# EAGLE design DigitalYSplitter (EAGLE 7.2.0)
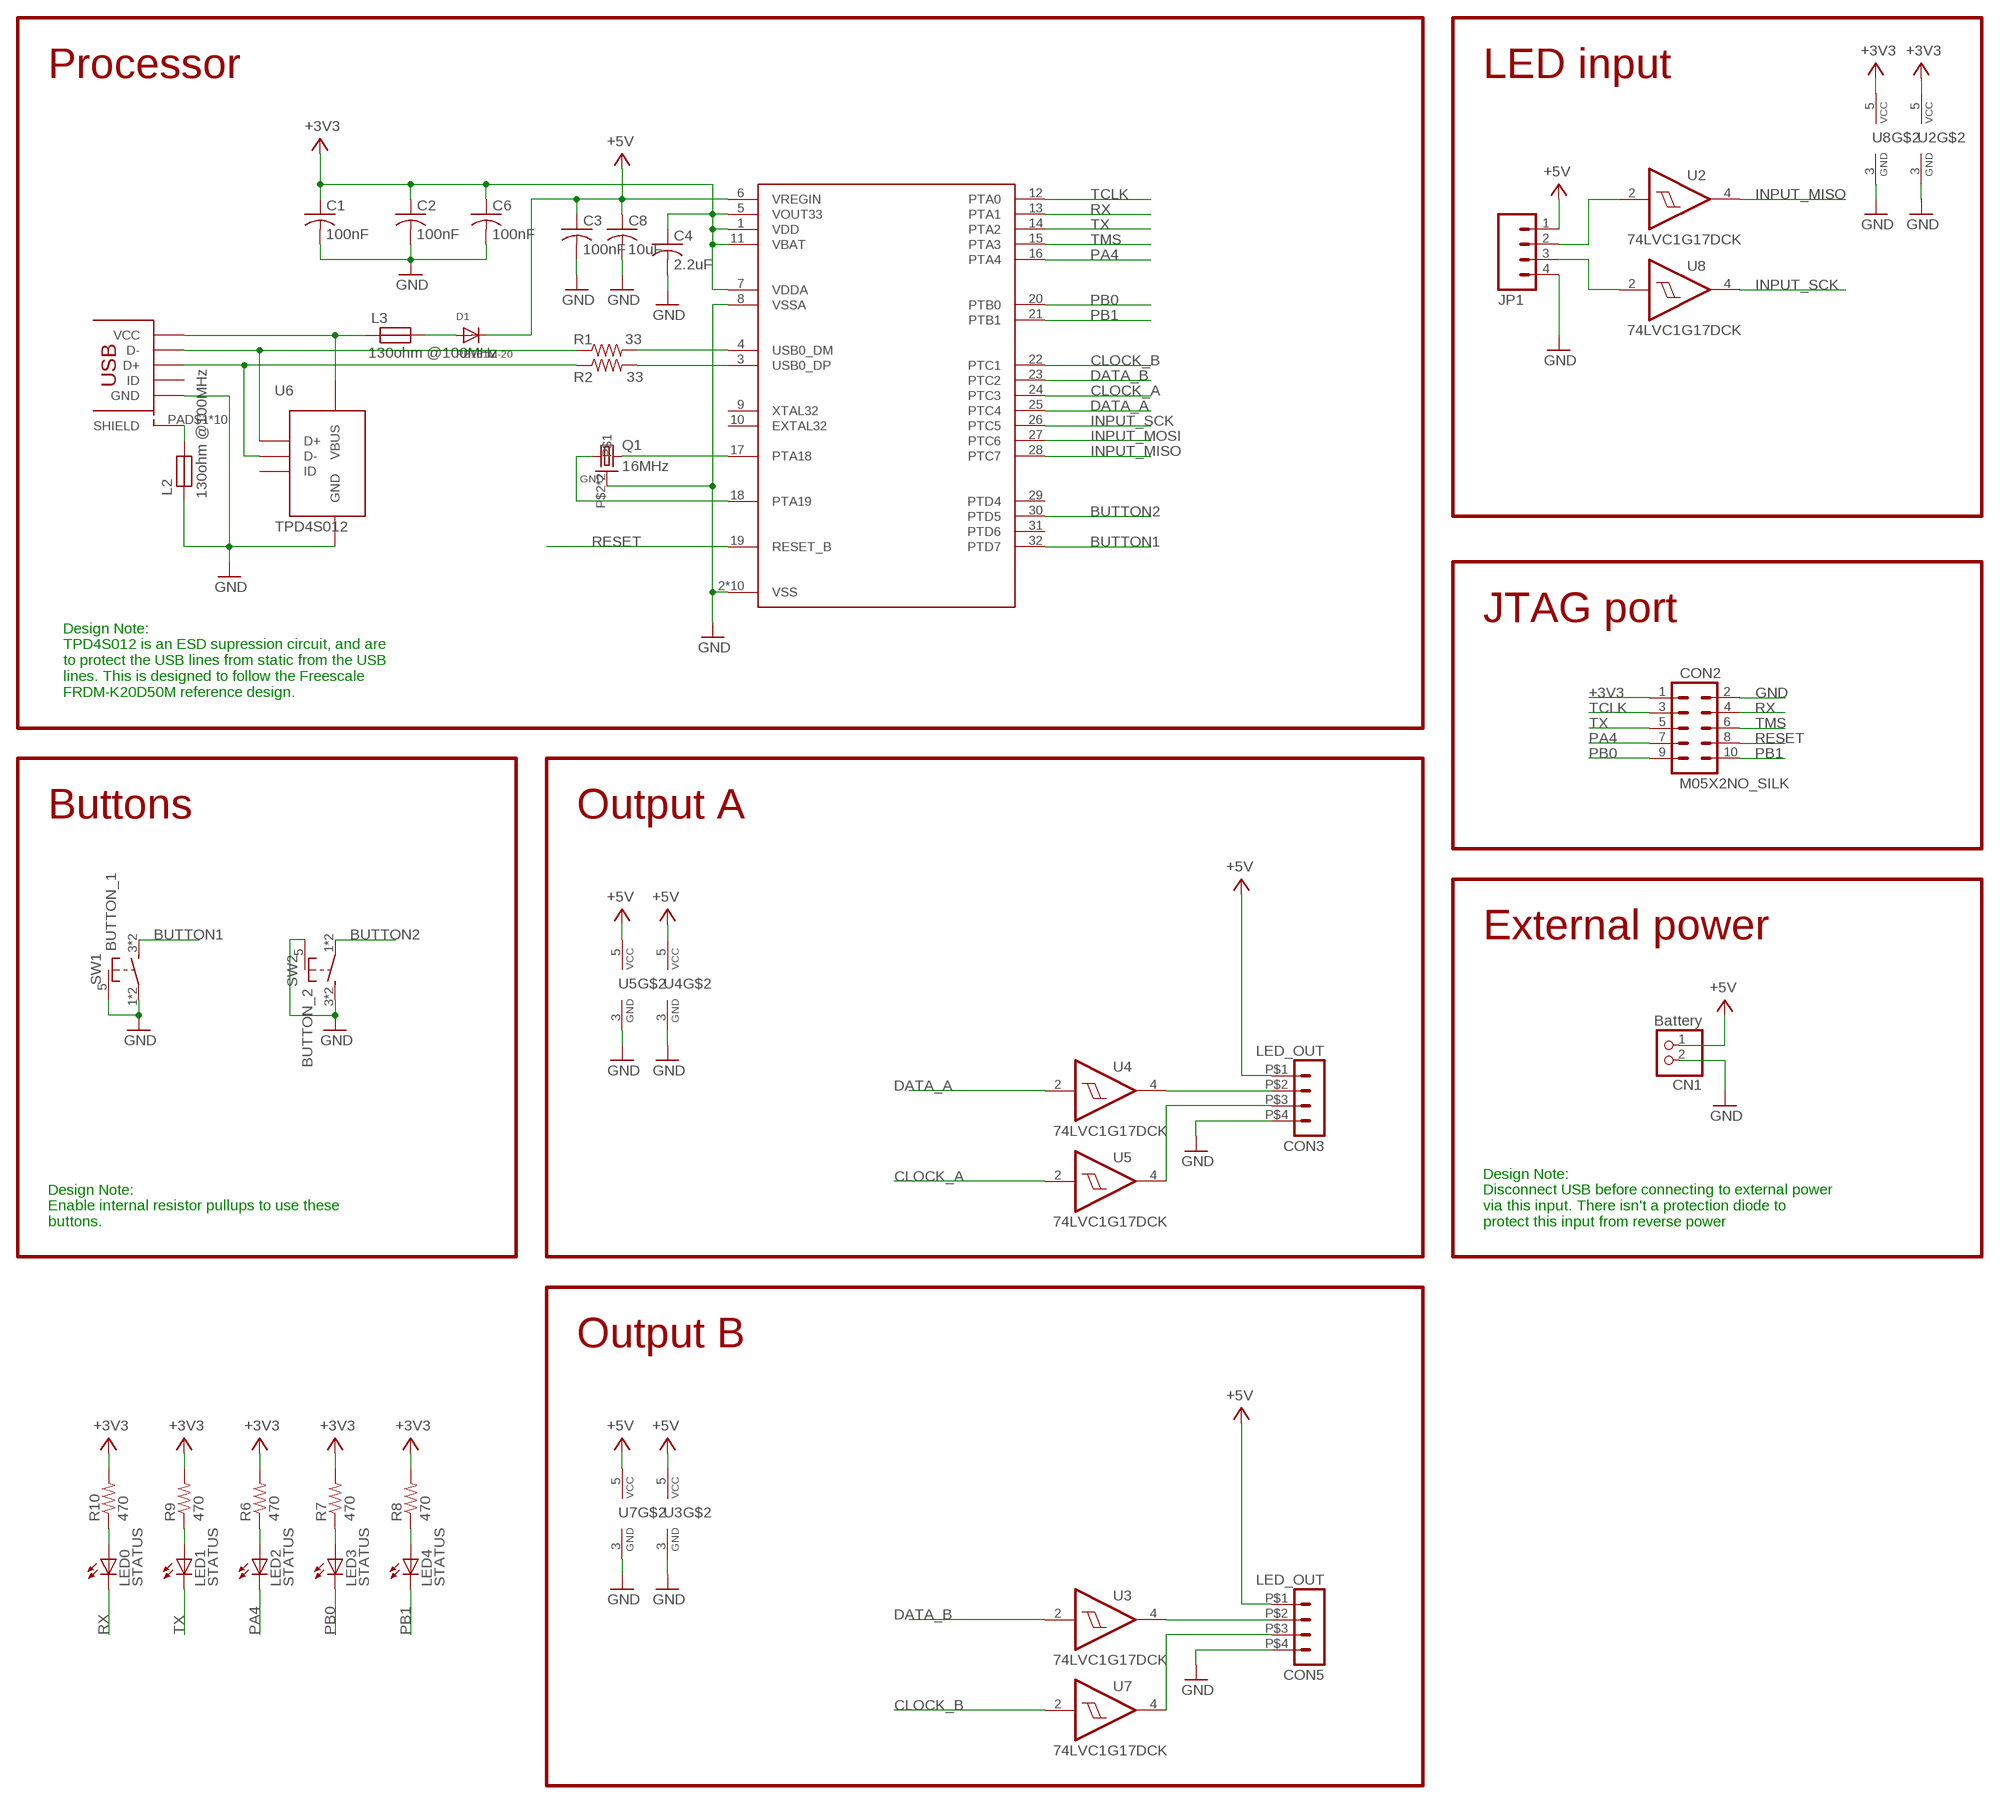
[diagram p0: schematic, sheet 1]

## Parts
C1  100nF  C-USC0402  [C0402]
C2  100nF  C-USC0402  [C0402]
C3  100nF  C-USC0402  [C0402]
C4  2.2uF  C-USC0402  [C0402]
C6  100nF  C-USC0402  [C0402]
C8  10uF  C-USC0805K  [C0805K]
CN1  Battery  JST_2PIN-THM-RA  [JST-PH-2-THM-RA]
CON1  USB_MICROSMT+THRUHULE  [USB_MICRO_THRUHOLE]
CON2  M05X2NO_SILK  [2X5_NOSILK]
CON3  LED_OUT  4-PIN_DUPONT  [DUPONT-4P]
CON5  LED_OUT  4-PIN_DUPONT  [DUPONT-4P]
D1  RB161M-20  DIODESOD-123  [SOD-123]
JP1  M04PTH  [1X04]
L2  130ohm @100MHz  FB0805/NO-OUTLINE  [0805]
L3  130ohm @100MHz  FB0805/NO-OUTLINE  [0805]
LED0  STATUS  LEDCHIPLED_0805  [CHIPLED_0805]
LED1  STATUS  LEDCHIPLED_0805  [CHIPLED_0805]
LED2  STATUS  LEDCHIPLED_0805  [CHIPLED_0805]
LED3  STATUS  LEDCHIPLED_0805  [CHIPLED_0805]
LED4  STATUS  LEDCHIPLED_0805  [CHIPLED_0805]
Q1  16MHz  CRYSTAL_4PAD2520  [CRSYTAL_2520]
R1  33  R-US_R0402  [R0402]
R2  33  R-US_R0402  [R0402]
R6  470  R-US_R0402  [R0402]
R7  470  R-US_R0402  [R0402]
R8  470  R-US_R0402  [R0402]
R9  470  R-US_R0402  [R0402]
R10  470  R-US_R0402  [R0402]
SW1  BUTTON_1  BUTTON_MOMENTARY_GROUND  [TD-07XB]
SW2  BUTTON_2  BUTTON_MOMENTARY_GROUND  [TD-07XB]
U1  MK20D--VFM5  [QFN32_5X5_LONGLEADS]
U2  74LVC1G17DCK  [SC70-5]
U3  74LVC1G17DCK  [SC70-5]
U4  74LVC1G17DCK  [SC70-5]
U5  74LVC1G17DCK  [SC70-5]
U6  TPD4S012  [R-PUSON-N6]
U7  74LVC1G17DCK  [SC70-5]
U8  74LVC1G17DCK  [SC70-5]

## Nets
+3V3: C1.1 C2.1 C4.1 C6.1 CON2.1 R6.2 R7.2 R8.2 R9.2 R10.2 U1.1(VDD) U1.5(VOUT33) U1.7(VDDA) U1.11(VBAT) U2.5(VCC) U8.5(VCC)
+5V: C3.1 C8.1 CN1.1 CON3.P$1 CON5.P$1 D1.C JP1.1 U1.6(VREGIN) U3.5(VCC) U4.5(VCC) U5.5(VCC) U7.5(VCC)
BUTTON1: SW1.3(S) SW1.4(S) U1.32(PTD7)
BUTTON2: SW2.1(P) SW2.2(P) U1.30(PTD5)
CLOCK_A: U1.24(PTC3) U5.2(I)
CLOCK_B: U1.22(PTC1) U7.2(I)
DATA_A: U1.25(PTC4) U4.2(I)
DATA_B: U1.23(PTC2) U3.2(I)
GND: C1.2 C2.2 C3.2 C4.2 C6.2 C8.2 CN1.2 CON1.PIN$5(GND) CON2.2 CON3.P$4 CON5.P$4 JP1.4 L2.2 Q1.P$2 Q1.P$4 SW1.1(P) SW1.2(P) SW1.5(SHIELD) SW2.3(S) SW2.4(S) SW2.5(SHIELD) U1.2(VSS) U1.8(VSSA) U1.PAD@1(VSS) U1.PAD@2(VSS) U1.PAD@3(VSS) U1.PAD@4(VSS) U1.PAD@5(VSS) U1.PAD@6(VSS) U1.PAD@9(VSS) U1.PAD@10(VSS) U1.PAD@11(VSS) U2.3(GND) U3.3(GND) U4.3(GND) U5.3(GND) U6.P$4(GND) U7.3(GND) U8.3(GND)
INPUT_MISO: U1.28(PTC7) U2.4(O)
INPUT_MOSI: U1.27(PTC6)
INPUT_SCK: U1.26(PTC5) U8.4(O)
LED_DATA: CON3.P$2 U4.4(O)
LED_DATA1: CON5.P$2 U3.4(O)
N$1: Q1.P$1 U1.18(PTA19)
N$2: Q1.P$3 U1.17(PTA18)
N$3: CON1.PIN$1(VCC) L3.2 U6.P$6(VBUS)
N$4: CON3.P$3 U5.4(O)
N$5: CON5.P$3 U7.4(O)
N$6: JP1.2 U2.2(I)
N$7: CON1.PIN$2(D-) R1.1 U6.P$1(D+)
N$8: JP1.3 U8.2(I)
N$9: D1.A L3.1
N$10: CON1.PIN$3(D+) R2.1 U6.P$2(D-)
N$11: R1.2 U1.4(USB0_DM)
N$12: R2.2 U1.3(USB0_DP)
N$13: LED2.A R6.1
N$14: LED3.A R7.1
N$15: LED4.A R8.1
N$17: LED1.A R9.1
N$18: LED0.A R10.1
PA4: CON2.7 LED2.C U1.16(PTA4)
PB0: CON2.9 LED3.C U1.20(PTB0)
PB1: CON2.10 LED4.C U1.21(PTB1)
RESET: CON2.8 U1.19(RESET_B)
RX: CON2.4 LED0.C U1.13(PTA1)
SHIELD: CON1.PAD$1(SHIELD) CON1.PAD$2(SHIELD) CON1.PAD$3(SHIELD) CON1.PAD$4(SHIELD) CON1.PAD$5(SHIELD) CON1.PAD$6(SHIELD) CON1.PAD$7(SHIELD) CON1.PAD$8(SHIELD) CON1.PAD$9(SHIELD) CON1.PAD$10(SHIELD) L2.1
TCLK: CON2.3 U1.12(PTA0)
TMS: CON2.6 U1.15(PTA3)
TX: CON2.5 LED1.C U1.14(PTA2)
Unconnected: CON1.PIN$4(ID) U1.9(XTAL32) U1.10(EXTAL32) U1.29(PTD4) U1.31(PTD6) U6.P$3(ID)

## Notes on the sheet
- Processor | LED input
- JTAG port
- Design Note:
  TPD4S012 is an ESD supression circuit, and are
  to protect the USB lines from static from the USB
  lines. This is designed to follow the Freescale
  FRDM-K20D50M reference design.
- Buttons | Output A
- External power
- Design Note:
  Enable internal resistor pullups to use these
  buttons.
- Design Note:
  Disconnect USB before connecting to external power
  via this input. There isn't a protection diode to
  protect this input from reverse power
- Output B

## Library data of the parts
C1-C4 C6 C8 = adafruit:C-US: CAPACITOR, American symbol
CN1 = adafruit:JST_2PIN: JST 2-Pin Connectors of various flavors SMT-RA (S2B-PH-SM4) 4UConnector #17311 SMT (B2B-PH-SM4) THM-RA (S2B-PH) THM (B2B-PH)
CON1 = blinkinlabs:USB_MICRO
CON2 = SparkFun-Connectors:M05X2: Header 5x2 Standard 10-pin dual row 0.1" header. Commonly used with AVR-ISP. Use with Spark Fun Electronics SKU: PRT-00778
CON3 CON5 = blinkinlabs:4-PIN_DUPONT: PIN HEADER
D1 = adafruit:DIODE: Diode SMADIODE - SMA Surface Mount Package 20V 1A Schottky Diode Digikey: 641-1014-6-ND DO-1N4148 - Through Hole Small Current Diode SOD-123 20V 1 A (.5mV Vf) Schottky Diode - Digikey: MBRX120TPMSCT-ND SOD-323 10V 570mA (.38mV Vf, 3ns) Schottky Diode - Digikey: ZLLS410CT-ND SOD-523 30V 30mA Schottky Diode (RB751S-40TE61) - Digikey: RB751S-40TE61CT-ND SOT23-R/W - SOT23 Package (R = Solder Paste/Reflow Ovens, W = Hand-Soldering) BAT54Film 40V 300mA - Digikey: 497-7162-1-ND
JP1 = SparkFun-Connectors:M04: Header 4 Standard 4-pin 0.1" header. Use with straight break away headers (SKU : PRT-00116), right angle break away headers (PRT-00553), swiss pins (PRT-00743), machine pins (PRT-00117), and female headers (PRT-00115). Molex polarized connector foot print use with SKU : PRT-08231 with associated crimp pins and housings. 1MM SMD Version SKU: PRT-10208
L2 L3 = blinkinlabs:FB
LED0 LED1-LED4 = adafruit:LED: LED OSRAM: - CHIPLED LG R971, LG N971, LY N971, LG Q971, LY Q971, LO R971, LY R971 LH N974, LH R974 LS Q976, LO Q976, LY Q976 LO Q996 - Hyper CHIPLED LW Q18S LB Q993, LB Q99A, LB R99A - SideLED LS A670, LO A670, LY A670, LG A670, LP A670 LB A673, LV A673, LT A673, LW A673 LH A674 LY A675 LS A676, LA A676, LO A676, LY A676, LW A676 LS A679, LY A679, LG A679 - Hyper Micro SIDELED® LS Y876, LA Y876, LO Y876, LY Y876 LT Y87S - SmartLED LW L88C, LW L88S LB L89C, LB L89S, LG L890 LS L89K, LO L89K, LY L89K LS L896, LA L896, LO L896, LY L896 - TOPLED LS T670, LO T670, LY T670, LG T670, LP T670 LSG T670, LSP T670, LSY T670, LOP T670, LYG T670 LG T671, LOG T671, LSG T671 LB T673, LV T673, LT T673, LW T673 LH T674 LS T676, LA T676, LO T676, LY T676, LB T676, LH T676, LSB T676, LW T676 LB T67C, LV T67C, LT T67C, LS T67K, LO T67K, LY T67K, LW E67C LS E67B, LA E67B, LO E67B, LY E67B, LB E67C, LV E67C, LT E67C LW T67C LS T679, LY T679, LG T679 LS T770, LO T770, LY T770, LG T770, LP T770 LB T773, LV T773, LT T773, LW T773 LH T774 LS E675, LA E675, LY E675, LS T675 LS T776, LA T776, LO T776, LY T776, LB T776 LHGB T686 LT T68C, LB T68C - Hyper Mini TOPLED® LB M676 - Mini TOPLED Santana® LG M470 LS M47K, LO M47K, LY M47K Source: http://www.osram.convergy.de/
Q1 = blinkinlabs:CRYSTAL_4PAD
R1 R2 R6-R10 = adafruit:R-US_: RESISTOR, American symbol
SW1 SW2 = blinkinlabs:BUTTON_MOMENTARY_GROUND
U1 = blinkinlabs:MK20D--VFM5
U2-U5 U7 U8 = 74xx-little-us:74*1G17: Single Schmitt-Trigger Buffer
U6 = blinkinlabs:TPD4S012: TPD4S012 4-Channel ESD Solution for USB-HS/USB OTG/USB Charger Interface

## Board
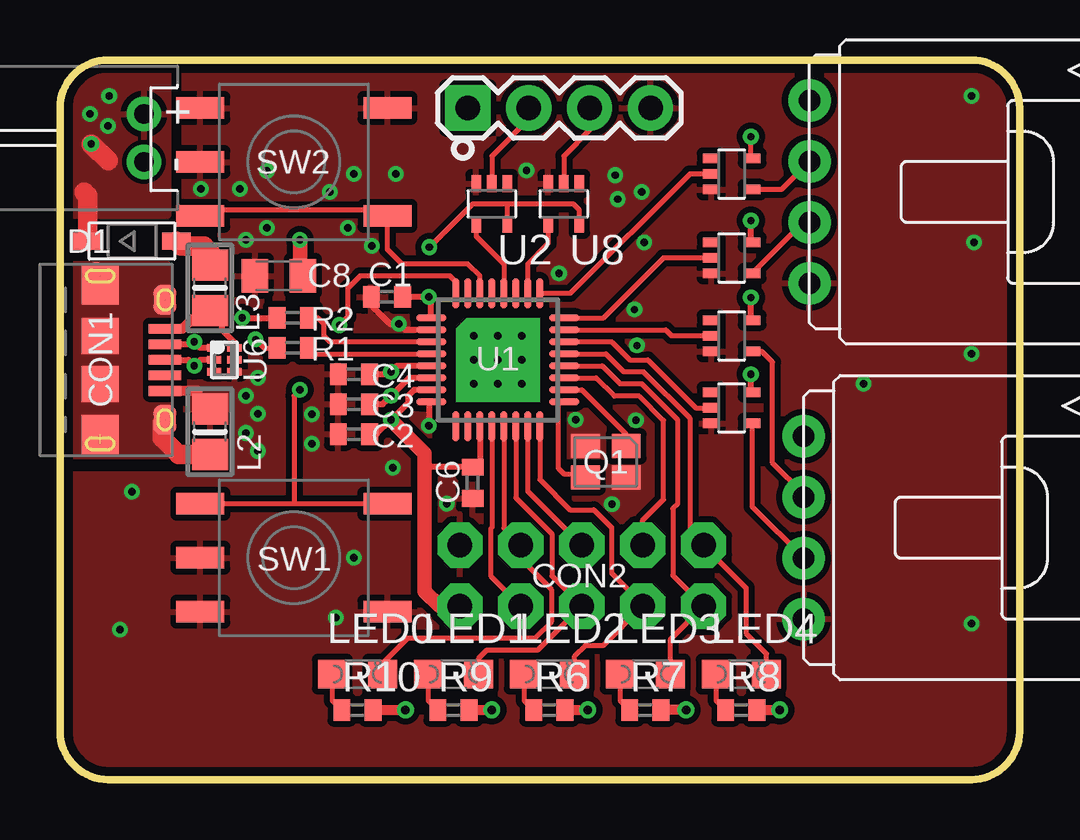
[diagram p1: board, top side]
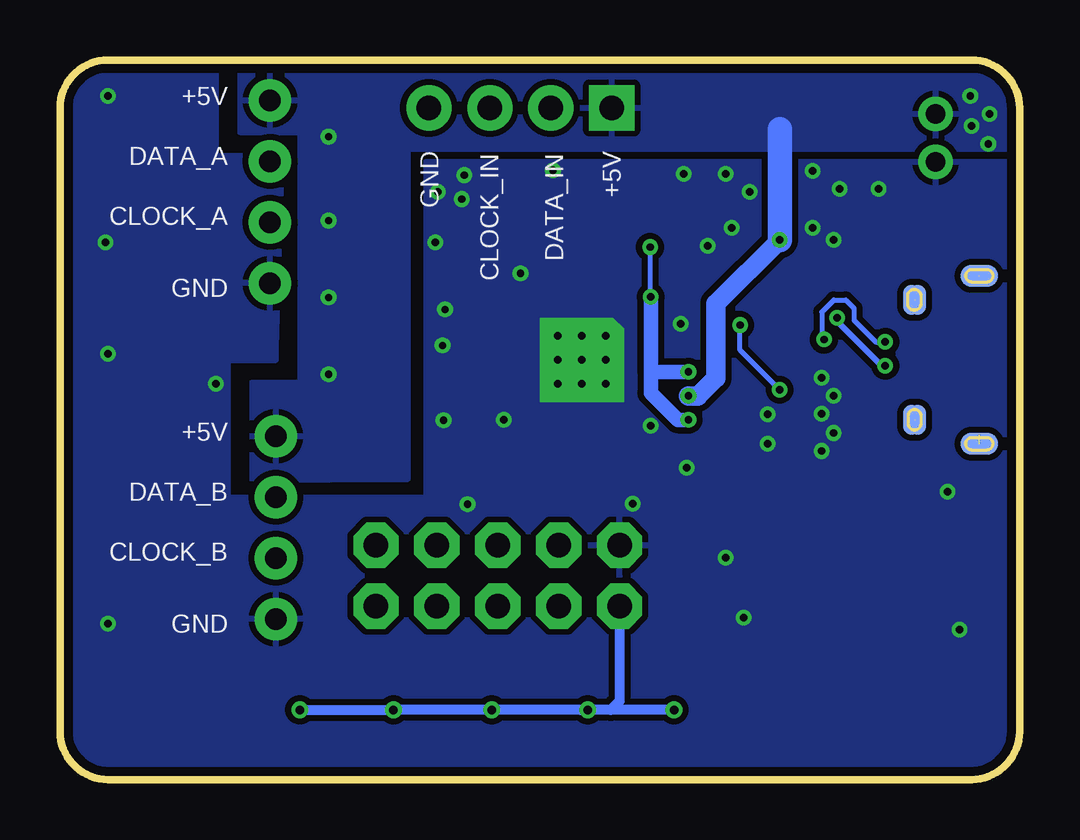
[diagram p2: board, bottom side, seen from below]

Size 40 x 30 mm. Coordinates in mm from the lower left corner, seen from the top.
Outline: 2,0 38,0 arc90 40,2 40,28 arc90 38,30 2,30 arc90 0,28 0,2 arc90 2,0
Copper layers (1*16): Top 0.0356mm / dielectric 1.5011mm / Bottom 0.0356mm
Design rules "BlinkyTape *": minimum track width 8mil, minimum drill 0.3mm, track to track 8mil, track to pad 8mil, pad to pad 8mil, via to via 8mil, smd to smd 8mil, copper to edge 15mil, drill to drill 0.25mm, minimum pad ring 7mil, minimum via ring 7mil, stop-mask expansion 2mil, vias tented up to drill 3mm, thermal gap 10mil
tRestrict: area 20.2,14.5 to 20.5,15.5; area 20,15.5 to 20.2,19.5; area 16.2,15.5 to 20.2,15.7; area 16.2,15.5 to 16.5,19.5; area 16.2,19.3 to 20.2,19.5; area 15.8,14 to 16.2,15.5

### Footprints (pad centres in the part's own frame; a part is rotated, then mirrored left to right if it is on the bottom)
C0402 = smd 0.7 x 0.9: 1 -0.65,0; 2 0.65,0
C0805K = smd 1.1 x 1.4: 1 -1,0; 2 1,0
JST-PH-2-THM-RA = drill 0.8 pad 1.422: 1 1,0; 2 -1,0
USB_MICRO_THRUHOLE = smd 1.645 x 1.55: PAD$1 -3.123,0; PAD$4 3.123,0 | smd 1.5 x 1.55: PAD$2 -1,0; PAD$3 1,0 | smd 1.25 x 0.95: PAD$5 -2.5,2.7; PAD$6 2.5,2.7 | smd 0.9 x 1.55 bottom: PAD$7 -3.5,0; PAD$8 3.5,0 | smd 1.25 x 0.95 bottom: PAD$9 -2.5,2.7; PAD$10 2.5,2.7 | smd 0.4 x 1.35: PIN$1 -1.3,2.7; PIN$2 -0.65,2.7; PIN$3 0,2.7; PIN$4 0.65,2.7; PIN$5 1.3,2.7
2X5_NOSILK = drill 1.016 pad 1.88 octagon: 1 -1.27,5.08; 2 1.27,5.08; 3 -1.27,2.54; 4 1.27,2.54; 5 -1.27,0; 6 1.27,0; 7 -1.27,-2.54; 8 1.27,-2.54; 9 -1.27,-5.08; 10 1.27,-5.08
DUPONT-4P = drill 0.9 pad 1.778: P$1 -3.81,0; P$2 -1.27,0; P$3 1.27,0; P$4 3.81,0
SOD-123 = smd 1.2 x 0.7: A 1.85,0; C -1.85,0
1X04 = drill 1.016 pad 1.88 square: 1 0,0 | drill 1.016 pad 1.88: 2 2.54,0; 3 5.08,0; 4 7.62,0
0805 = smd 1.3 x 1.5: 1 -0.95,0; 2 0.95,0
CHIPLED_0805 = smd 1.2 x 1.2: A 0,-1.05; C 0,1.05
CRSYTAL_2520 = smd 1.2 x 1: P$1 -0.85,-0.65; P$2 0.85,-0.65; P$3 0.85,0.65; P$4 -0.85,0.65
R0402 = smd 0.7 x 0.9: 1 -0.65,0; 2 0.65,0
TD-07XB = smd 2 x 0.9: 1 -3.9,-2.25; 2 3.9,-2.25; 3 -3.9,2.25; 4 3.9,2.25; 5 -3.9,0
QFN32_5X5_LONGLEADS = smd 1.25 x 0.275: 1 -2.775,1.75; 2 -2.775,1.25; 3 -2.775,0.75; 4 -2.775,0.25; 5 -2.775,-0.25; 6 -2.775,-0.75; 7 -2.775,-1.25; 8 -2.775,-1.75; 17 2.775,-1.75; 18 2.775,-1.25; 19 2.775,-0.75; 20 2.775,-0.25; 21 2.775,0.25; 22 2.775,0.75; 23 2.775,1.25; 24 2.775,1.75 | smd 0.275 x 1.25: 9 -1.75,-2.775; 10 -1.25,-2.775; 11 -0.75,-2.775; 12 -0.25,-2.775; 13 0.25,-2.775; 14 0.75,-2.775; 15 1.25,-2.775; 16 1.75,-2.775; 25 1.75,2.775; 26 1.25,2.775; 27 0.75,2.775; 28 0.25,2.775; 29 -0.25,2.775; 30 -0.75,2.775; 31 -1.25,2.775; 32 -1.75,2.775 | drill 0.3 pad 1.5 octagon: PAD@1 -1,1 | drill 0.3 pad 1.5 square: PAD@2 0,1; PAD@3 1,0; PAD@4 1,1; PAD@5 -1,0; PAD@6 0,0; PAD@9 -1,-1; PAD@10 0,-1; PAD@11 1,-1
SC70-5 = smd 0.4 x 0.7: 1 -0.65,-0.85; 2 0,-0.85; 3 0.65,-0.85; 4 0.65,0.85; 5 -0.65,0.85
R-PUSON-N6 = smd 0.3 x 0.6: P$1 -0.5,-0.425; P$2 0,-0.425; P$3 0.5,-0.425; P$4 0.5,0.425; P$5 0,0.425; P$6 -0.5,0.425

### Placement (x,y rotation side)
C1  13.62,20.12 180 top
C2  12.25,14.4 180 top
C3  12.25,15.65 180 top
C4  12.25,16.9 180 top
C6  17.2,12.38 270 top
C8  9.12,21 180 top
CN1  3.5,26.75 90 top
CON1  1.68,17.5 270 top
CON2  21.75,8.5 90 top
CON3  31.25,24.5 270 top
CON5  31,10.5 270 top
D1  3,22.45 0 top
JP1  17,28 0 top
L2  6.25,14.5 90 top
L3  6.25,20.5 270 top
LED0  12.4,4.4 270 top
LED1  16.4,4.4 270 top
LED2  20.4,4.4 270 top
LED3  24.4,4.4 270 top
LED4  28.4,4.4 270 top
Q1  22.75,13.25 180 top
R1  9.7,18 0 top
R2  9.7,19.25 0 top
R6  20.4,2.9 0 top
R7  24.4,2.9 0 top
R8  28.4,2.9 0 top
R9  16.4,2.9 0 top
R10  12.4,2.9 0 top
SW1  9.75,9.25 0 top
SW2  9.75,25.75 0 top
U1  18.25,17.5 0 top
U2  18,24 180 top
U3  28,18.5 270 top
U4  28,25.25 270 top
U5  28,21.75 270 top
U6  6.85,17.5 270 top
U7  28,15.5 270 top
U8  21,24 180 top

### Tracks (layer width: path | path; a pad name or v marks a point on that pad's centre or on a via)
+3V3  (via drill 0.3, 0.35)
  Top 0.203: 15.22,13.53 15.2,13.5 | U8.5 21.65,23.75 21.4,24 18.65,24 | 18.65,24 17.2,24 v15.4,22.2 | U2.5 18.65,24
  Top 0.254: U1.1 15.47,20.02 v15.38,20.12 C1.1 | U1.5 14.05,17.25 v13.8,17 13.7,16.9 C4.1 | U1.7 14.75,16.25 14.5,16 14.5,15.7 v13.8,15 13.2,14.4 C2.1 | U1.11 17.5,13.32 C6.1 15.22,13.03 15.2,13
  Top 0.406: R10.2 v14.4,2.9 | R8.2 v30,2.9 | v26.1,2.9 R7.2 | R6.2 v22,2.9 | R9.2 v18,2.9
  Top 0.61: v13.8,15 15.2,13.6 15.2,13.5 15.2,13 15.2,7.85 15.82,7.23 CON2.1
  Bottom 0.203: v15.4,22.2 15.4,20.15 v15.38,20.12
  Bottom 0.406: v14.4,2.9 R9.2 | R9.2 v18,2.9 | v18,2.9 18.3,2.9 | v30,2.9 v26.1,2.9 v22,2.9 v18,2.9 | CON2.1 16.67,3.28 R9.2
  Bottom 0.61: 15.38,17 v15.38,20.12 | v13.8,17 15.38,17 | 15.38,17 15.38,16.12 14.25,15 v13.8,15
+5V  (via drill 0.3)
  Top 0.203: U4.5 28.8,25.95 v28.8,26.8
  Top 0.254: U1.6 14.55,16.75 v13.8,16 | 13.55,15.75 v13.8,16 | C3.1 13.45,15.65 v13.8,16 | U5.5 28.8,22.45 v28.8,23.3 | U3.5 28.8,19.2 v28.8,20.1 | U7.5 28.8,16.2 v28.8,16.9
  Top 0.61: v10,22.5 10,21.12 C8.1
  Top 0.813: 1.55,26.25 v1.3,26.5 2,25.8 | D1.C 1.15,24.35 1,24.5
  Bottom 0.813: v13.8,16 13.4,16 12.65,16.75 12.65,19.85 v10,22.5
  Bottom 1.016: v10,22.5 10,27.12
  other vias: 2,27.25 1.25,27.75 2.05,28.5
  pour Bottom (isolate 0.254): 0,32 32.5,32 32.5,27 30,27 30,16.54 32,16.54 32,12.5 25.5,12.54 25.5,26.3 0,26.3
  pour Top: 0,29.5 4.5,29.5 4.5,23.5 0,23.5
BUTTON1  (via drill 0.3)
  Top 0.203: U1.32 16.5,20.75 16.25,21 12.5,21 12,20.5 12,19.3 v11.65,18.95 | v10,16.25 9.75,16 9.75,11.5 | SW1.4 9.75,11.5 | 9.75,11.5 SW1.3
  Bottom 0.203: v10,16.25 11.65,17.9 v11.65,18.95
BUTTON2
  Top 0.203: SW2.1 6.5,23.5 6.5,23.75 13,23.75 13,23.5 SW2.2 13.65,22.1 14.25,21.5 17,21.5 17.5,21 U1.30
CLOCK_A
  Top 0.203: U1.24 22.65,19.25 25.15,21.75 U5.2
CLOCK_B
  Top 0.203: U1.22 23,18.25 23.75,17.5 24.5,17.5 26.5,15.5 U7.2
DATA_A
  Top 0.203: U4.2 26.25,25.25 21.27,20.27 U1.25
DATA_B
  Top 0.203: U1.23 25.25,18.75 25.5,18.5 U3.2
GND  (via drill 0.3)
  Top 0.254: C1.2 12.97,19.77 13.75,19 v14.12,19 14.38,18.75 U1.2 | U1.8 15.38,15.65 v15.38,14.75
  Top 0.406: 5.75,16.2 CON1.PIN$5
  other vias: 21.5,15 10.5,14 23.01,11.48 20.8,21.1 13.88,13 8.62,23 10.5,15.22 5.88,24.62 7.5,24.62 8.62,25.38 7.75,16 12.25,9.25 7.75,22.5 24.01,14.98 38,6.5 12,23 11.25,24.5 14,25.25 13,22.25 33.5,16.5 38,28.5 38.1,22.4 16.12,11.5 2.5,6.25 11.5,6.75 12.25,25.25 38,17.75 8.25,15.25 7.75,14.45 8.25,13.7 3,12 8.25,16.75 24.05,18.1 23.95,19.6 24.25,24.5 24.35,22.4 23.15,25.2 23.25,24.2 19.45,25.4
  pour Top (isolate 0.254): 5.2,32 47.62,32 47.62,-0.5 -2.5,-0.5 -2.5,12.75 5.25,12.75 5.25,22.25 5.2,22.25
  pour Bottom (isolate 0.254): 24.75,11.75 33,11.75 33,17.5 31,17.5 31,18 30.75,26 33.5,26 33.5,32 47.12,32 47.12,-0.5 -1.5,-0.5 -1.5,16.21 -1.44,24.5 -1.44,25.75 24.75,25.75
  pour Top (no thermals): 5.5,16.3 7.5,16.3 7.5,15.5 5.5,15.5
INPUT_MISO
  Top 0.203: U2.4 17.35,22.65 18.5,21.5 U1.28
INPUT_SCK
  Top 0.203: U1.26 19.5,21.5 20.35,22.35 U8.4
LED_DATA
  Top 0.203: CON3.P$2 30.08,24.6 U4.4
LED_DATA1
  Top 0.203: CON5.P$2 31,11.9 29.7,13.2 29.7,17.4 29.25,17.85 U3.4
N$1
  Top 0.203: U1.18 21.75,16.25 23.6,14.4 Q1.P$1
N$2
  Top 0.203: Q1.P$3 21.75,12.75 21,12.75 20.77,12.97 20.77,15.75 U1.17
N$3
  Top 0.254: U6.P$6 7.28,18.23 6.75,18.75 6.75,19.05 L3.2
  Top 0.406: CON1.PIN$1 5.11,18.8 5.5,19.19 5.89,19.19 L3.2
N$4
  Top 0.203: U5.4 30.98,23.23 CON3.P$3
N$5
  Top 0.203: U7.4 28.85,11.38 CON5.P$3
N$6
  Top 0.203: JP1.2 19.54,27.54 18,26 U2.2
N$7  (via drill 0.3)
  Top 0.203: v8.15,18.35 8.5,18 R1.1
  Top 0.254: CON1.PIN$2 5.5,18.15 v5.6,18.25 5.85,18 U6.P$1
  Bottom 0.203: v5.6,18.25 6,18.25 6.9,19.15 6.9,19.65 7.25,20 7.75,20 8.25,19.5 8.25,18.45 v8.15,18.35
N$8
  Top 0.203: JP1.3 22.08,27.08 21,26 U8.2
N$9
  Top 0.813: L3.1 6.25,22 6,22.25 5.05,22.25 D1.A
N$10  (via drill 0.3)
  Top 0.254: v7.6,19.25 R2.1 | CON1.PIN$3 5.35,17.5 v5.6,17.25 5.85,17.5 U6.P$2
  Bottom 0.254: v7.6,19.25 7.6,19.1 5.75,17.25 v5.6,17.25
N$11
  Top 0.203: R1.2 10.6,17.75 U1.4
N$12
  Top 0.203: U1.3 11.25,18.25 11,18.5 11,19 10.75,19.25 R2.2 10.3,19.25
N$13
  Top 0.203: LED2.A 19.35,3.3 R6.1
N$14
  Top 0.203: LED3.A 23.35,3.3 R7.1
N$15
  Top 0.203: LED4.A 27.35,3.3 R8.1
N$17
  Top 0.203: LED1.A 15.35,3.3 R9.1
N$18
  Top 0.203: LED0.A 11.35,3.3 R10.1
PA4
  Top 0.203: U1.16 20,12.51 21.26,11.25 22.25,11.25 23,10.5 23,8.6 24.29,7.31 CON2.7 22.66,5.6 21.9,5.6 21.45,5.15 LED2.C
PB0
  Top 0.203: U1.20 22.61,17.25 23.36,16.5 24.25,16.5 25.75,15 25.75,11.5 25.55,11.3 25.55,8.51 CON2.9 25.45,5.85 LED3.C
PB1
  Top 0.203: U1.21 22.75,17.75 23.5,17 24.33,17 26.25,15.08 26.25,10.35 CON2.10 28.6,8 28.6,6.1 29.45,5.25 LED4.C
RESET
  Top 0.203: CON2.8 24.29,10.8 25.16,11.67 25.16,14.98 24.15,15.98 23.11,15.98 22.34,16.75 U1.19
RX
  Top 0.203: U1.13 18.5,10.48 CON2.4 19.21,9.19 20.5,7.9 20.5,6.6 19.8,5.9 14.5,5.9 13.45,4.85 LED0.C
SHIELD  (4 unrouted)
  Top 0.813: 1.5,21.18 CON1.PAD$7 | L2.1 4.95,13.55 4.25,14.25 4.25,14.88 CON1.PAD$10
  pour Top (isolate 0.254): -2.5,21.5 -2.5,13.5 4.5,13.5 4.5,21.5
TCLK
  Top 0.203: U1.12 18,10.5 17.95,10.45 17.95,8.49 CON2.3
TMS
  Top 0.203: CON2.6 19.5,12.02 U1.15
TX
  Top 0.203: U1.14 19,11.75 20.5,10.25 20.5,8.48 CON2.5 19.92,5.4 17.8,5.4 17.45,5.05 LED1.C

### Text on the board
bNames: +5V | +5V | DATA_IN | CLOCK_IN | GND | DATA_A | CLOCK_A | GND | +5V | DATA_B | CLOCK_B | GND
tDocu: Blinkinlabs Digital Y splitter / Revision A, 2015-07-03 | 30 | 60 | 120 | APA102 | WS2812